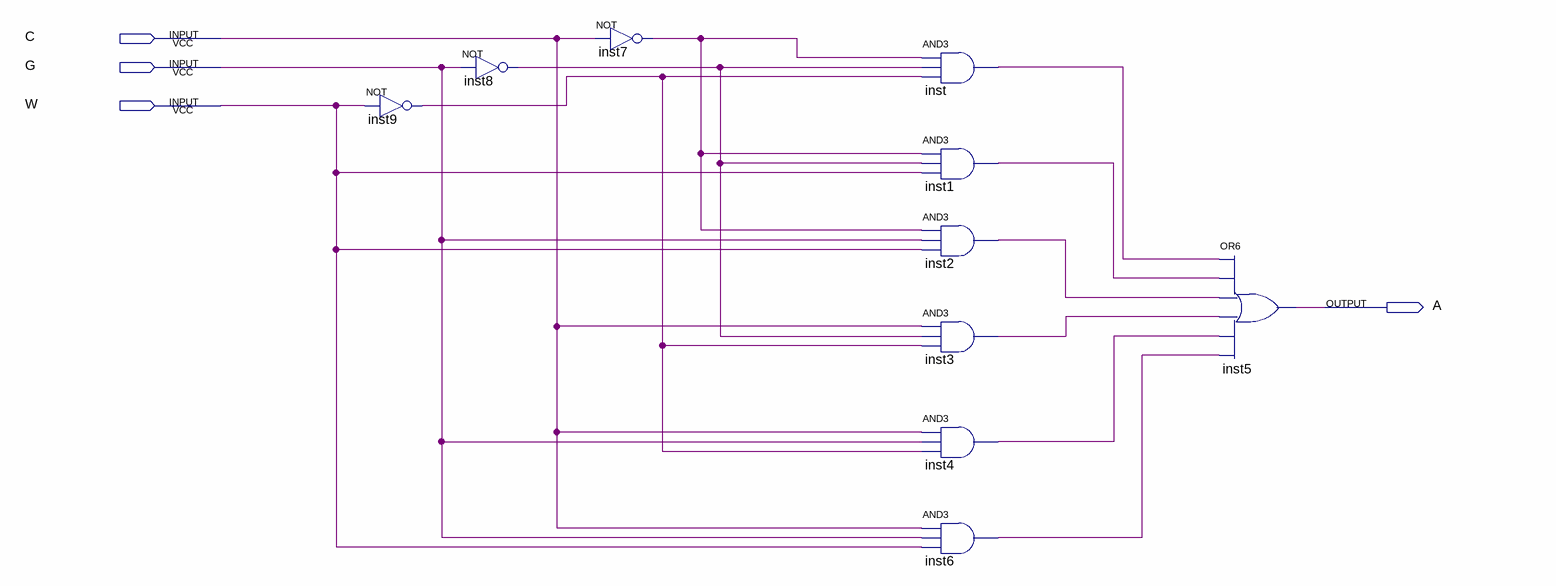
[diagram p0: schematic sheet]
// Quartus schematic lab2step2.bdf as structural Verilog: 10 symbols, 4 pins
module lab2step2 (
  input  C,
  input  G,
  input  W,
  output A
);

  wire inst1_out, inst2_out, inst3_out, inst4_out, inst6_out, inst7_out, inst8_out, inst9_out, inst_out;

  not inst9 (inst9_out, W);
  not inst8 (inst8_out, G);
  not inst7 (inst7_out, C);
  and inst (inst_out, inst7_out, inst8_out, inst9_out);
  and inst1 (inst1_out, inst7_out, inst8_out, W);
  and inst2 (inst2_out, inst7_out, G, W);
  and inst3 (inst3_out, C, inst8_out, inst9_out);
  and inst4 (inst4_out, C, G, inst9_out);
  and inst6 (inst6_out, C, G, W);
  or inst5 (A, inst_out, inst1_out, inst2_out, inst3_out, inst4_out, inst6_out);
endmodule
